# EAGLE schematic elysium_v0_3 (EAGLE 6.5.0)
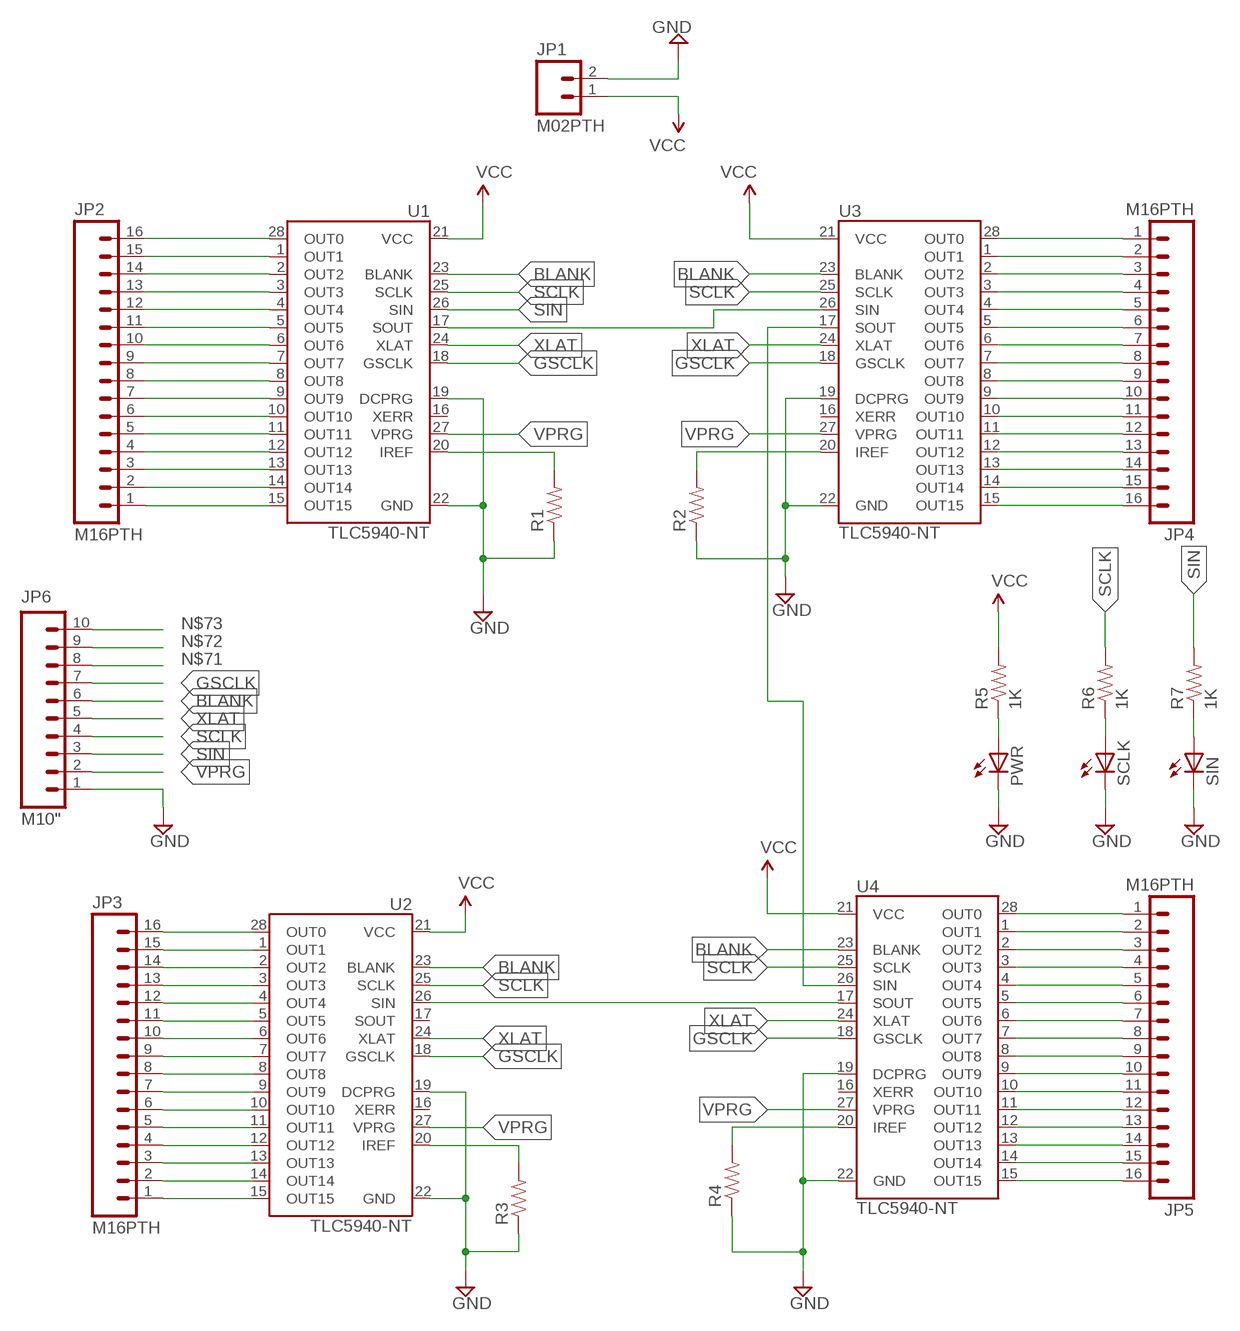
[diagram p0: schematic, sheet 1]

## Parts
JP1  M02PTH  [1X02]
JP2  M16PTH  [1X16]
JP3  M16PTH  [1X16]
JP4  M16PTH  [1X16]
JP5  M16PTH  [1X16]
JP6  M10"  [1X10]
PWR  LED5MM  [LED5MM]
R1  RESISTOREZ  [AXIAL-0.3EZ]
R2  RESISTOREZ  [AXIAL-0.3EZ]
R3  RESISTOREZ  [AXIAL-0.3EZ]
R4  RESISTOREZ  [AXIAL-0.3EZ]
R5  1K  RESISTOREZ  [AXIAL-0.3EZ]
R6  1K  RESISTOREZ  [AXIAL-0.3EZ]
R7  1K  RESISTOREZ  [AXIAL-0.3EZ]
SCLK  LED5MM  [LED5MM]
SIN  LED5MM  [LED5MM]
U1  TLC5940-NT  [DIL28-3]
U2  TLC5940-NT  [DIL28-3]
U3  TLC5940-NT  [DIL28-3]
U4  TLC5940-NT  [DIL28-3]

## Nets
BLANK: JP6.6 U1.23(BLANK) U2.23(BLANK) U3.23(BLANK) U4.23(BLANK)
GND: JP1.2 JP6.1 PWR.K(C) R1.P$1 R2.P$1 R3.P$1 R4.P$1 SCLK.K(C) SIN.K(C) U1.19(DCPRG) U1.22(GND) U2.19(DCPRG) U2.22(GND) U3.19(DCPRG) U3.22(GND) U4.19(DCPRG) U4.22(GND)
GSCLK: JP6.7 U1.18(GSCLK) U2.18(GSCLK) U3.18(GSCLK) U4.18(GSCLK)
N$1: JP2.16 U1.28(OUT0)
N$2: JP2.15 U1.1(OUT1)
N$3: JP2.14 U1.2(OUT2)
N$4: JP2.13 U1.3(OUT3)
N$5: JP2.12 U1.4(OUT4)
N$6: JP2.11 U1.5(OUT5)
N$7: JP2.10 U1.6(OUT6)
N$8: JP2.9 U1.7(OUT7)
N$9: JP2.8 U1.8(OUT8)
N$10: JP2.7 U1.9(OUT9)
N$11: JP2.6 U1.10(OUT10)
N$12: JP2.5 U1.11(OUT11)
N$13: JP2.4 U1.12(OUT12)
N$14: JP2.3 U1.13(OUT13)
N$15: JP2.2 U1.14(OUT14)
N$16: JP2.1 U1.15(OUT15)
N$17: JP4.1 U3.28(OUT0)
N$18: JP4.2 U3.1(OUT1)
N$19: JP4.3 U3.2(OUT2)
N$20: JP4.4 U3.3(OUT3)
N$21: JP4.5 U3.4(OUT4)
N$22: JP4.6 U3.5(OUT5)
N$23: JP4.7 U3.6(OUT6)
N$24: JP4.8 U3.7(OUT7)
N$25: JP4.9 U3.8(OUT8)
N$26: JP4.10 U3.9(OUT9)
N$27: JP4.11 U3.10(OUT10)
N$28: JP4.12 U3.11(OUT11)
N$29: JP4.13 U3.12(OUT12)
N$30: JP4.14 U3.13(OUT13)
N$31: JP4.15 U3.14(OUT14)
N$32: JP4.16 U3.15(OUT15)
N$33: JP3.16 U2.28(OUT0)
N$34: JP3.15 U2.1(OUT1)
N$35: JP3.14 U2.2(OUT2)
N$36: JP3.13 U2.3(OUT3)
N$37: JP3.12 U2.4(OUT4)
N$38: JP3.11 U2.5(OUT5)
N$39: JP3.10 U2.6(OUT6)
N$40: JP3.9 U2.7(OUT7)
N$41: JP3.8 U2.8(OUT8)
N$42: JP3.7 U2.9(OUT9)
N$43: JP3.6 U2.10(OUT10)
N$44: JP3.5 U2.11(OUT11)
N$45: JP3.4 U2.12(OUT12)
N$46: JP3.3 U2.13(OUT13)
N$47: JP3.2 U2.14(OUT14)
N$48: JP3.1 U2.15(OUT15)
N$49: JP5.1 U4.28(OUT0)
N$50: JP5.2 U4.1(OUT1)
N$51: JP5.3 U4.2(OUT2)
N$52: JP5.4 U4.3(OUT3)
N$53: JP5.5 U4.4(OUT4)
N$54: JP5.6 U4.5(OUT5)
N$55: JP5.7 U4.6(OUT6)
N$56: JP5.8 U4.7(OUT7)
N$57: JP5.9 U4.8(OUT8)
N$58: JP5.10 U4.9(OUT9)
N$59: JP5.11 U4.10(OUT10)
N$60: JP5.12 U4.11(OUT11)
N$61: JP5.13 U4.12(OUT12)
N$62: JP5.14 U4.13(OUT13)
N$63: JP5.15 U4.14(OUT14)
N$64: JP5.16 U4.15(OUT15)
N$65: U1.17(SOUT) U3.26(SIN)
N$66: U3.17(SOUT) U4.26(SIN)
N$67: U2.26(SIN) U4.17(SOUT)
N$68: R1.P$2 U1.20(IREF)
N$69: PWR.A R5.P$1
N$70: R2.P$2 U3.20(IREF)
N$71: JP6.8
N$72: JP6.9
N$73: JP6.10
N$74: R6.P$1 SCLK.A
N$75: R3.P$2 U2.20(IREF)
N$76: R7.P$1 SIN.A
N$77: R4.P$2 U4.20(IREF)
SCLK: JP6.4 R6.P$2 U1.25(SCLK) U2.25(SCLK) U3.25(SCLK) U4.25(SCLK)
SIN: JP6.3 R7.P$2 U1.26(SIN)
VCC: JP1.1 R5.P$2 U1.21(VCC) U2.21(VCC) U3.21(VCC) U4.21(VCC)
VPRG: JP6.2 U1.27(VPRG) U2.27(VPRG) U3.27(VPRG) U4.27(VPRG)
XLAT: JP6.5 U1.24(XLAT) U2.24(XLAT) U3.24(XLAT) U4.24(XLAT)
Unconnected: U1.16(XERR) U2.16(XERR) U2.17(SOUT) U3.16(XERR) U4.16(XERR)

## Library data of the parts
JP1 = SparkFun-Connectors:M02: Standard 2-pin 0.1" header. Use with - straight break away headers ( PRT-00116) - right angle break away headers (PRT-00553) - swiss pins (PRT-00743) - machine pins (PRT-00117) - female headers (PRT-00115) Molex polarized connector foot print use with: PRT-08233 with associated crimp pins and housings. 2.54_SCREWTERM for use with PRT-10571. 3.5mm Screw Terminal footprints for PRT-08084 5mm Screw Terminal footprints for use with PRT-08433
JP2-JP5 = SparkFun-Connectors:M16: 1x16 .1" header
JP6 = SparkFun-Connectors:M10: Header 10 Standard 10-pin 0.1" header. Use with straight break away headers (SKU : PRT-00116), right angle break away headers (PRT-00553), swiss pins (PRT-00743), machine pins (PRT-00117), and female headers (PRT-00115).
PWR SCLK SIN = adafruit:LED: LED OSRAM: - CHIPLED LG R971, LG N971, LY N971, LG Q971, LY Q971, LO R971, LY R971 LH N974, LH R974 LS Q976, LO Q976, LY Q976 LO Q996 - Hyper CHIPLED LW Q18S LB Q993, LB Q99A, LB R99A - SideLED LS A670, LO A670, LY A670, LG A670, LP A670 LB A673, LV A673, LT A673, LW A673 LH A674 LY A675 LS A676, LA A676, LO A676, LY A676, LW A676 LS A679, LY A679, LG A679 - Hyper Micro SIDELED® LS Y876, LA Y876, LO Y876, LY Y876 LT Y87S - SmartLED LW L88C, LW L88S LB L89C, LB L89S, LG L890 LS L89K, LO L89K, LY L89K LS L896, LA L896, LO L896, LY L896 - TOPLED LS T670, LO T670, LY T670, LG T670, LP T670 LSG T670, LSP T670, LSY T670, LOP T670, LYG T670 LG T671, LOG T671, LSG T671 LB T673, LV T673, LT T673, LW T673 LH T674 LS T676, LA T676, LO T676, LY T676, LB T676, LH T676, LSB T676, LW T676 LB T67C, LV T67C, LT T67C, LS T67K, LO T67K, LY T67K, LW E67C LS E67B, LA E67B, LO E67B, LY E67B, LB E67C, LV E67C, LT E67C LW T67C LS T679, LY T679, LG T679 LS T770, LO T770, LY T770, LG T770, LP T770 LB T773, LV T773, LT T773, LW T773 LH T774 LS E675, LA E675, LY E675, LS T675 LS T776, LA T776, LO T776, LY T776, LB T776 LHGB T686 LT T68C, LB T68C - Hyper Mini TOPLED® LB M676 - Mini TOPLED Santana® LG M470 LS M47K, LO M47K, LY M47K Source: http://www.osram.convergy.de/
R1-R7 = SparkFun-Resistors:RESISTOR: Resistor Basic schematic elements and footprints for 0603, 1206, and PTH resistors.
U1-U4 = SparkFun-DigitalIC:TLC5940: 16-channel LED Driver with Dot Correction and Grayscale PWM Control The TLC5940 is a 16-channel, constant-current sink LED driver. Each channel has an individually adjustable 4096-step grayscale PWM brightness control and a 64-step, constant-current sink (dot correction). The dot correction adjusts the brightness variations between LED channels and other LED drivers. The dot correction data is stored in an integrated EEPROM. Both grayscale control and dot correction are accessible via a serial interface. A single external resistor sets the maximum current value of all 16 channels. Packages: 28-pin HTSSOP 32-pin 5x5mm QFN 28-pin DIP